# EAGLE design imu (EAGLE 7.3.0)
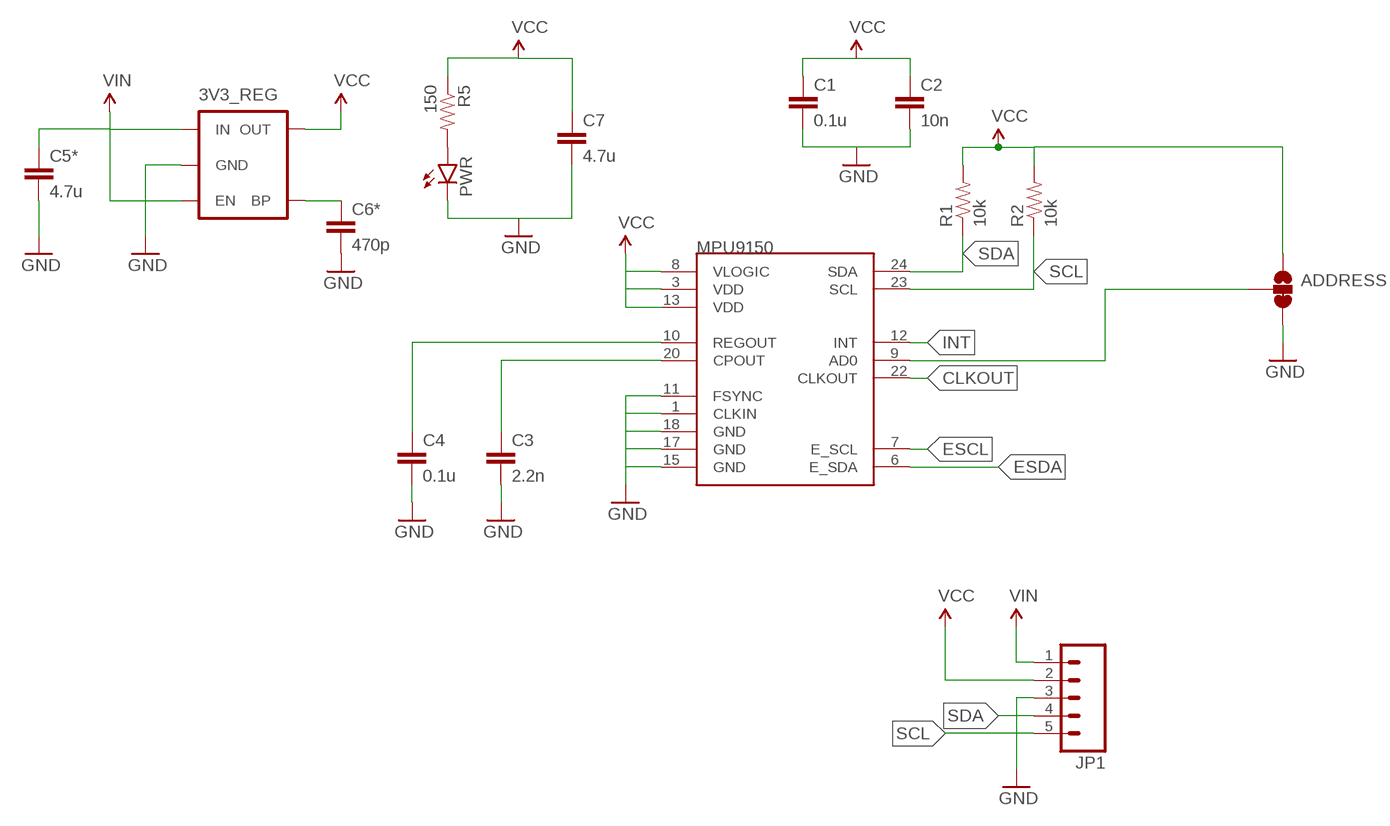
[diagram p0: schematic, sheet 1]

## Parts
3V3_REG  MIC52053.3V  [SOT23-5]
ADDRESS  JUMPER-PAD-3-2OF3_NC_BY_TRACE_SMALL  [PAD-JUMPER-3-2OF3_NC_BY_TRACE_YES_SILK_FULL_BOX]
C1  0.1u  CAP0805  [0805]
C2  10n  CAP0805  [0805]
C3  2.2n  CAP0805  [0805]
C4  0.1u  CAP0805  [0805]
C5*  4.7u  CAP0805  [0805]
C6*  470p  CAP0805  [0805]
C7  4.7u  CAP0805  [0805]
JP1  M05SMD2  [1X05-1MM-RA]
MPU9150  MPU-9150QFN-24-NP  [QFN-24-NP]
PWR  LED0805  [LED-0805]
R1  10k  RESISTOR0805-RES  [0805]
R2  10k  RESISTOR0805-RES  [0805]
R5  150  RESISTOR0805-RES  [0805]

## Nets
AD0: ADDRESS.2 MPU9150.9(AD0)
CLKOUT: MPU9150.22(CLKOUT)
ESCL: MPU9150.7(E_SCL)
ESDA: MPU9150.6(E_SDA)
GND: 3V3_REG.2(GND) ADDRESS.3 C1.2 C2.2 C3.2 C4.2 C5*.2 C6*.2 C7.2 JP1.3 MPU9150.1(CLKIN) MPU9150.11(FSYNC) MPU9150.15(GND) MPU9150.17(GND) MPU9150.18(GND) PWR.CATHODE(C)
INT: MPU9150.12(INT)
N$1: PWR.ANODE(A) R5.2
N$4: C3.1 MPU9150.20(CPOUT)
N$5: C4.1 MPU9150.10(REGOUT)
N$7: 3V3_REG.4(BP) C6*.1
SCL: JP1.5 MPU9150.23(SCL) R2.1
SDA: JP1.4 MPU9150.24(SDA) R1.1
VCC: 3V3_REG.5(OUT) ADDRESS.1 C1.1 C2.1 C7.1 JP1.2 MPU9150.3(VDD) MPU9150.8(VLOGIC) MPU9150.13(VDD) R1.2 R2.2 R5.1
VIN: 3V3_REG.1(IN) 3V3_REG.3(EN) C5*.1 JP1.1

## Library data of the parts
3V3_REG = SparkFun-PowerIC:MIC5205: MIC5205 150mA vreg 3.3V - VREG-00822 5V - VREG-00823; PROD_ID: VREG-00822
ADDRESS = SparkFun-Passives:JUMPER-PAD-3-2OF3_NC_BY_TRACE
C1-C4 C5* C6* C7 = SparkFun-Passives:CAP: Capacitor Standard 0603 ceramic capacitor, and 0.1" leaded capacitor.
JP1 = SparkFun-Connectors:M05: Header 5 Standard 5-pin 0.1" header. Use with straight break away headers (SKU : PRT-00116), right angle break away headers (PRT-00553), swiss pins (PRT-00743), machine pins (PRT-00117), and female headers (PRT-00115). Molex polarized connector foot print use with SKU : PRT-08230 with associated crimp pins and housings.
MPU9150 = SparkFun-Sensors:MPU-9150: 9DOF (3mag, 3accel, 3rotat). I2C interface.
PWR = SparkFun-LED:LED: LEDs Standard schematic elements and footprints for 5mm, 3mm, 1206, and 0603 sized LEDs. 5mm - Spark Fun Electronics SKU : COM-00529 (and others)
R1 R2 R5 = SparkFun-Passives:RESISTOR: Resistor Basic schematic elements and footprints for 0603, 1206, and PTH resistors.

## Board
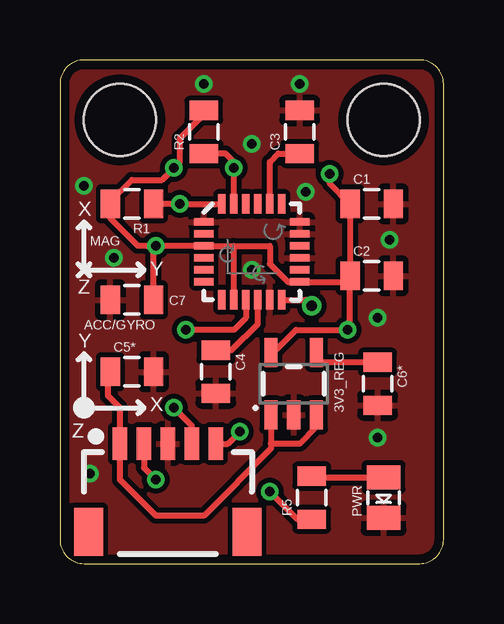
[diagram p1: board, top side]
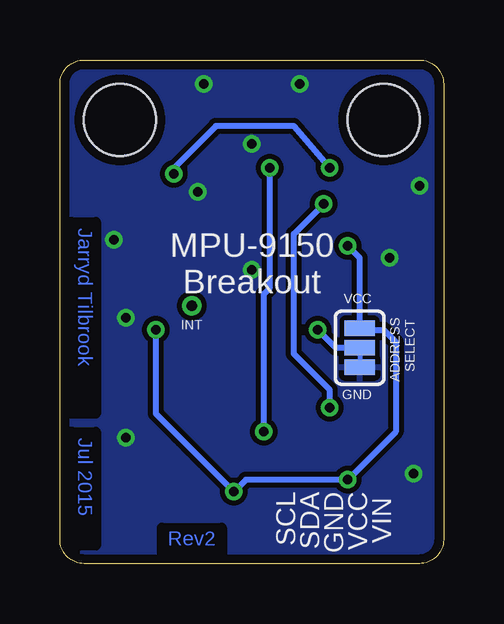
[diagram p2: board, bottom side, seen from below]

Size 16 x 21 mm. Coordinates in mm from the lower left corner, seen from the top.
Outline: 0,20 0,1 arc90 1,0 15,0 arc90 16,1 16,20 arc90 15,21 1,21 arc90 0,20
Copper layers (1*16): Top 0.0356mm / dielectric 1.5011mm / Bottom 0.0356mm
Design rules "LaenPCBOrder": minimum track width 6mil, minimum drill 13mil, track to track 6mil, track to pad 6mil, pad to pad 6mil, via to via 6mil, smd to smd 6mil, copper to edge 15mil, drill to drill 6mil, minimum pad ring 7mil, minimum via ring 7mil, stop-mask expansion 3mil, vias tented up to drill 0mil, thermal gap 10mil
Holes 3 mm at 13.5,18.5 2.5,18.5
bRestrict: area 14.5,0.8 to 15.5,5.5; area 9.2,0.5 to 11.8,1.5; area 14.5,6.2 to 15.5,14.2

### Footprints (pad centres in the part's own frame; a part is rotated, then mirrored left to right if it is on the bottom)
SOT23-5 = smd 0.55 x 1.2: 1 -0.95,-1.3; 2 0,-1.3; 3 0.95,-1.3; 4 0.95,1.3; 5 -0.95,1.3
PAD-JUMPER-3-2OF3_NC_BY_TRACE_YES_SILK_FULL_BOX = smd 0.635 x 1.27: 1 -0.813,0; 2 0,0; 3 0.813,0
0805 = smd 0.8 x 1.2: 1 -0.9,0; 2 0.9,0
1X05-1MM-RA = smd 0.6 x 1.35: 1 -2,0; 2 -1,0; 3 0,0; 4 1,0; 5 2,0 | smd 1.2 x 2: NC1 3.3,-3.675; NC2 -3.3,-3.675
QFN-24-NP = smd 0.8 x 0.3: 1 -2,1.25; 2 -2,0.75; 3 -2,0.25; 4 -2,-0.25; 5 -2,-0.75; 6 -2,-1.25; 13 2,-1.25; 14 2,-0.75; 15 2,-0.25; 16 2,0.25; 17 2,0.75; 18 2,1.25 | smd 0.3 x 0.8: 7 -1.25,-2; 8 -0.75,-2; 9 -0.25,-2; 10 0.25,-2; 11 0.75,-2; 12 1.25,-2; 19 1.25,2; 20 0.75,2; 21 0.25,2; 22 -0.25,2; 23 -0.75,2; 24 -1.25,2
LED-0805 = smd 1 x 1.4: ANODE -0.85,0; CATHODE 0.85,0

### Placement (x,y rotation side)
3V3_REG  9.75,7.5 0 top
ADDRESS  3.5,9 270 bottom
C1  13,15 0 top
C2  13,12 0 top
C3  10,18 90 top
C4  6.5,8 270 top
C5*  3,8 0 top
C6*  13.25,7.5 270 top
C7  3,11 180 top
JP1  4.5,5 0 top
MPU9150  8,13 0 top
PWR  13.5,2.75 270 top
R1  3,15 180 top
R2  6,18 90 top
R5  10.5,2.75 90 top

### Tracks (layer width: path | path; a pad name or v marks a point on that pad's centre or on a via)
AD0  (via drill 0.38)
  Top 0.254: MPU9150.9 7.75,10.25 7.25,9.75 v5.25,9.75
  Bottom 0.254: ADDRESS.2 4.5,9 v5.25,9.75
GND  (via drill 0.38)
  other vias: 13.25,5.25 10.25,15.5 13.25,10.25 2.25,12.75 8,12.25 8,17.5 6,20 13.75,13.5 10,20 1.25,3.75 1,15.75
  pour Top (isolate 0.203): 0,0 16,0 16,21 0,21
  pour Bottom (isolate 0.203): 16,0 0,0 0,21 16,21
INT  (via drill 0.46)
  Top 0.254: MPU9150.12 10.25,11 v10.5,10.75
N$1
  Top 0.254: R5.2 10.5,3.6 PWR.ANODE
N$4
  Top 0.254: MPU9150.20 8.75,16.75 9.1,17.1 C3.1
N$5
  Top 0.254: C4.1 7.15,8.9 8.25,10 MPU9150.10
N$7
  Top 0.254: 3V3_REG.4 10.7,8.4 C6*.1
SCL  (via drill 0.38)
  Top 0.254: MPU9150.23 v7.25,16.5 7.25,16.75 7.12,16.88 6.9,17.1 R2.1 | JP1.5 7,5 v7.5,5.5
  Bottom 0.254: v7.5,5.5 7.5,11.25 7.25,11.5 v7.25,16.5
SDA  (via drill 0.38)
  Top 0.254: R1.1 v5,15 MPU9150.24 | JP1.4 5.5,5.75 v4.75,6.5
  Bottom 0.254: v4.75,6.5 4.75,7.25 6.25,8.75 6.25,13.75 v5,15
VCC  (via drill 0.38)
  Top 0.254: C2.1 C1.1 11.25,15.85 v11.25,16.25 | 3V3_REG.5 8.9,8.8 9.85,9.75 v12,9.75 12.1,9.85 C2.1 | C2.1 11.85,11.75 MPU9150.13 9.5,11.75 8.75,12.5 8.75,13.25 7.25,13.25 | JP1.2 3.5,4 v4,3.5 | v8.75,3 9.9,1.85 R5.1 | 3.9,13.25 3.25,13.25 2.1,14.4 R1.2 2.1,15.1 3,16 4.25,16 v4.75,16.5 5,16.75 5,17.75 6,18.75 R2.2 | C7.1 3.9,13.25 | 3.9,13.25 v4,13.25 MPU9150.3 7.25,13.25 | MPU9150.8 7.25,13.25
  Bottom 0.254: v4,13.25 3.5,12.75 ADDRESS.1 3.56,9.75 | 3.56,9.75 2.5,9.75 2,9.25 2,5.5 v4,3.5 8.25,3.5 v8.75,3 12,6.25 v12,9.75 | 3.75,9.75 3.56,9.75 | v11.25,16.25 11.25,16.5 9.5,18.25 6.25,18.25 v4.75,16.5
VIN
  Top 0.254: C5*.1 2,7.9 2,7 2.5,6.5 JP1.1 2.5,3.5 4,2 6,2 8.8,4.8 8.8,5 | 3V3_REG.1 8.8,5 | 3V3_REG.3 10.7,5.7 10,5 8.8,5

### Text on the board
Bottom: Jarryd Tilbrook | Jul 2015 | Rev2
tPlace: X | MAG | Y | Z | ACC/GYRO | Y | X | Z
bPlace: VCC | MPU-9150 / Breakout | INT | SELECT | GND | VIN | VCC | GND | SDA | SCL